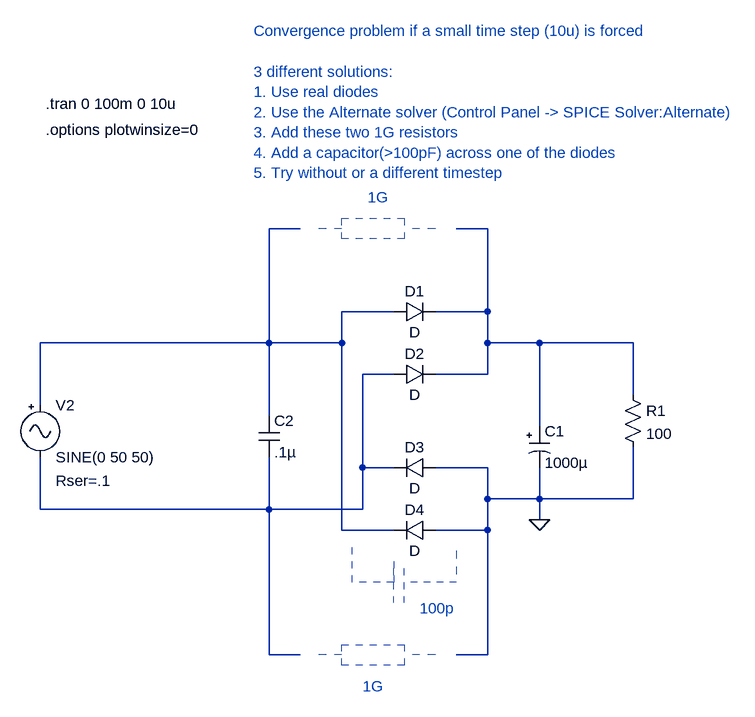
[diagram p0: schematic Bridge_Rectifier_conv.asc]
Bridge_Rectifier_conv.asc, the LTspice schematic file:
Version 4
SHEET 1 1036 680
WIRE -416 192 -416 96
WIRE -416 352 -416 272
WIRE -64 96 -416 96
WIRE -64 96 -64 -80
WIRE -64 208 -64 96
WIRE -64 352 -416 352
WIRE -64 352 -64 272
WIRE -64 576 -64 352
WIRE -16 -80 -64 -80
WIRE -16 576 -64 576
WIRE 48 96 -64 96
WIRE 48 96 48 48
WIRE 48 384 48 96
WIRE 80 288 80 144
WIRE 80 352 -64 352
WIRE 80 352 80 288
WIRE 128 48 48 48
WIRE 128 144 80 144
WIRE 128 288 80 288
WIRE 128 384 48 384
WIRE 272 -80 224 -80
WIRE 272 48 192 48
WIRE 272 48 272 -80
WIRE 272 96 272 48
WIRE 272 144 192 144
WIRE 272 144 272 96
WIRE 272 288 192 288
WIRE 272 336 272 288
WIRE 272 384 192 384
WIRE 272 384 272 336
WIRE 272 576 224 576
WIRE 272 576 272 384
WIRE 352 96 272 96
WIRE 352 224 352 96
WIRE 352 336 272 336
WIRE 352 336 352 288
WIRE 352 368 352 336
WIRE 496 96 352 96
WIRE 496 176 496 96
WIRE 496 336 352 336
WIRE 496 336 496 256
FLAG 352 368 0
SYMBOL Misc\\signal -416 176 R0
WINDOW 123 0 0 Left 0
WINDOW 39 24 132 Left 0
SYMATTR SpiceLine Rser=.1
SYMATTR InstName V2
SYMATTR Value SINE(0 50 50)
SYMBOL polcap 336 224 R0
SYMATTR InstName C1
SYMATTR Value 1000µ
SYMATTR SpiceLine Rser=.01
SYMBOL diode 128 64 R270
WINDOW 0 32 32 VTop 0
WINDOW 3 0 32 VBottom 0
SYMATTR InstName D1
SYMBOL diode 128 160 R270
WINDOW 0 32 32 VTop 0
WINDOW 3 0 32 VBottom 0
SYMATTR InstName D2
SYMBOL diode 192 272 R90
WINDOW 0 0 32 VBottom 0
WINDOW 3 32 32 VTop 0
SYMATTR InstName D3
SYMBOL diode 192 368 R90
WINDOW 0 0 32 VBottom 0
WINDOW 3 32 32 VTop 0
SYMATTR InstName D4
SYMBOL res 480 160 R0
SYMATTR InstName R1
SYMATTR Value 100
SYMBOL cap -80 208 R0
SYMATTR InstName C2
SYMATTR Value .1µ
TEXT -408 -272 Left 0 !.tran 0 100m 0 10u
TEXT -88 -384 Left 0 ;Convergence problem if a small time step (10u) is forced \n \n3 different solutions:\n1. Use real diodes\n2. Use the Alternate solver (Control Panel -> SPICE Solver:Alternate)\n3. Add these two 1G resistors\n4. Add a capacitor(>100pF) across one of the diodes\n5. Try without or a different timestep
TEXT 88 -128 Left 0 ;1G
TEXT 80 624 Left 0 ;1G
TEXT -408 -232 Left 0 !.options plotwinsize=0
TEXT 168 504 Left 0 ;100p
LINE Normal 64 464 64 400 2
LINE Normal 128 464 64 464 2
LINE Normal 128 432 128 464 2
LINE Normal 128 496 128 432 2
LINE Normal 144 496 144 432 2
LINE Normal 224 464 144 464 2
LINE Normal 224 416 224 464 2
LINE Normal 48 592 48 560 2
LINE Normal 144 592 48 592 2
LINE Normal 144 560 144 592 2
LINE Normal 48 560 144 560 2
LINE Normal 192 576 144 576 2
LINE Normal 48 576 0 576 2
LINE Normal 48 -64 48 -96 2
LINE Normal 144 -64 48 -64 2
LINE Normal 144 -96 144 -64 2
LINE Normal 48 -96 144 -96 2
LINE Normal 192 -80 144 -80 2
LINE Normal 48 -80 0 -80 2

The netlist it stands for:
* Bridge_Rectifier_conv.asc
V2 N001 N002 SINE(0 50 50) Rser=.1
C1 N003 0 1000µ Rser=.01
D1 N001 N003 D
D2 N002 N003 D
D3 0 N002 D
D4 0 N001 D
R1 N003 0 100
C2 N001 N002 .1µ
.model D D
.lib standard.dio
.tran 0 100m 0 10u
* Convergence problem if a small time step (10u) is forced
* 3 different solutions:
* 1. Use real diodes
* 2. Use the Alternate solver (Control Panel -> SPICE Solver:Alternate)
* 3. Add these two 1G resistors
* 4. Add a capacitor(>100pF) across one of the diodes
* 5. Try without or a different timestep
* 1G
* 1G
.options plotwinsize=0
* 100p
.backanno
.end